# EAGLE design Player Board (EAGLE 6.2)
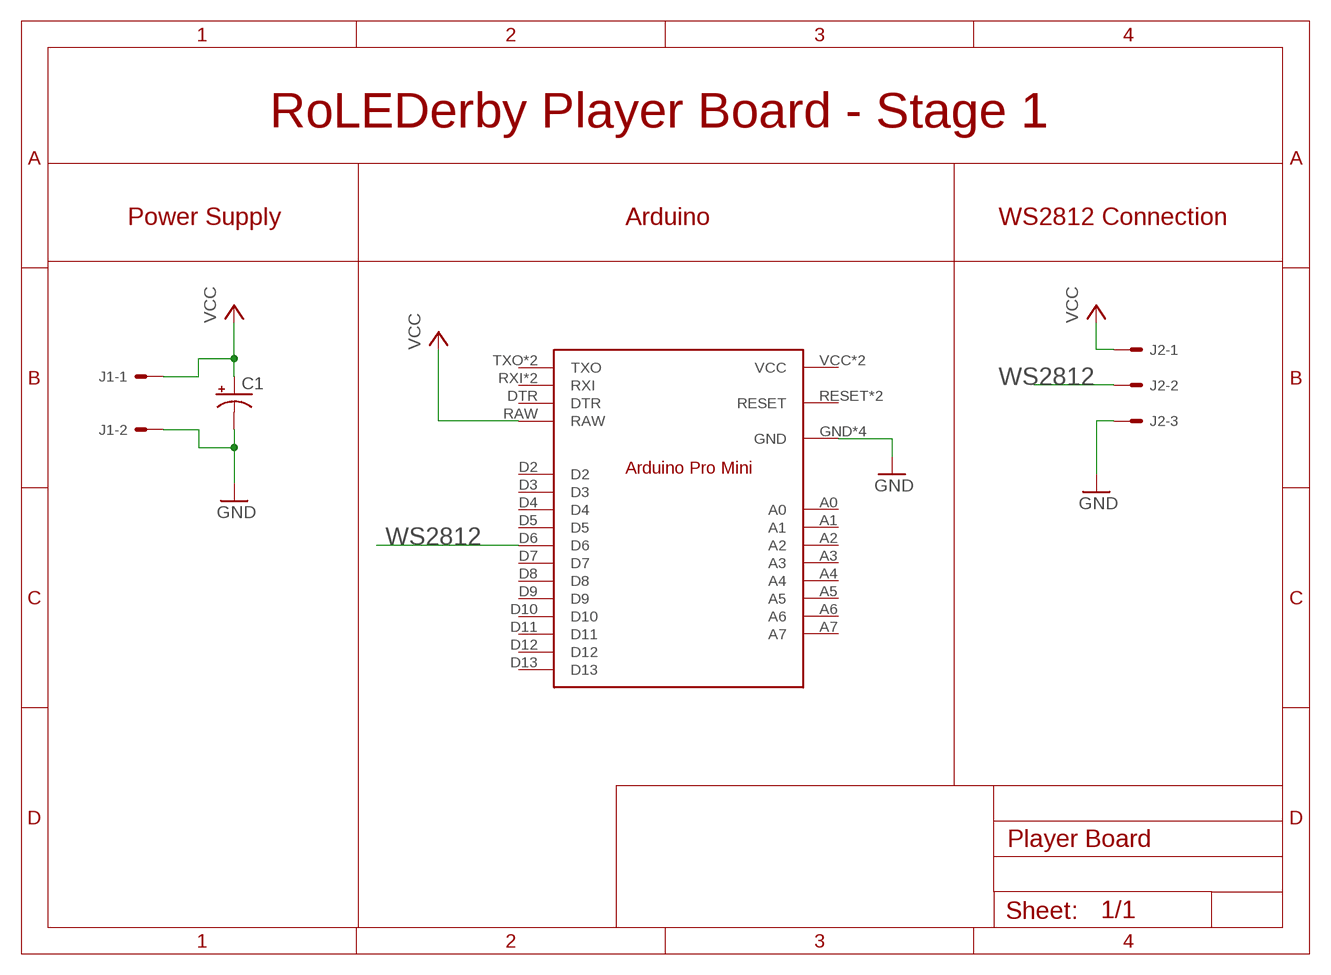
[diagram p0: schematic, sheet 1]

## Parts
C1  CAP_POLPTH2  [CPOL-RADIAL-10UF-25V]
J1  22-27-2021-02  [6410-02]
J2  22-27-2031-03  [6410-03]
U$1  ARDUINO_PRO_MINI  [ARDUINO_PRO_MINI]

## Nets
GND: C1.2(-) J1.2 J2.3 U$1.GND U$1.GND1(GND) U$1.GND2(GND) U$1.GND3(GND)
VCC: C1.1(+) J1.1 J2.1 U$1.RAW
WS2812: J2.2 U$1.D6
Unconnected: U$1.A0 U$1.A1 U$1.A2 U$1.A3 U$1.A4 U$1.A5 U$1.A6 U$1.A7 U$1.D2 U$1.D3 U$1.D4 U$1.D5 U$1.D7 U$1.D8 U$1.D9 U$1.D10 U$1.D11 U$1.D12 U$1.D13 U$1.DTR U$1.RESET U$1.RESET1(RESET) U$1.RXI U$1.RXI1(RXI) U$1.TXO U$1.TXO1(TXO) U$1.VCC U$1.VCC1(VCC)

## Notes on the sheet
- RoLEDerby Player Board - Stage 1
- Power Supply | Arduino | WS2812 Connection

## Library data of the parts
C1 = SparkFun-Capacitors:CAP_POL: Capacitor Polarized These are standard SMD and PTH capacitors. Normally 10uF, 47uF, and 100uF in electrolytic and tantalum varieties. Always verify the external diameter of the through hole cap, it varies with capacity, voltage, and manufacturer. The EIA devices should be standard.
J1 = con-molex:22-?-02: CONNECTOR wire to board 2.54 mm (.1 inch) pitch header; OC_FARNELL: unknown; OC_NEWARK: unknown
J2 = con-molex:22-?-03: CONNECTOR wire to board 2.54 mm (.1 inch) pitch header; OC_FARNELL: unknown; OC_NEWARK: unknown
U$1 = MimaZ:ARDUINO_PRO_MINI: Arduino Pro Mini http://arduino.cc/en/Main/ArduinoBoardProMini

## Board
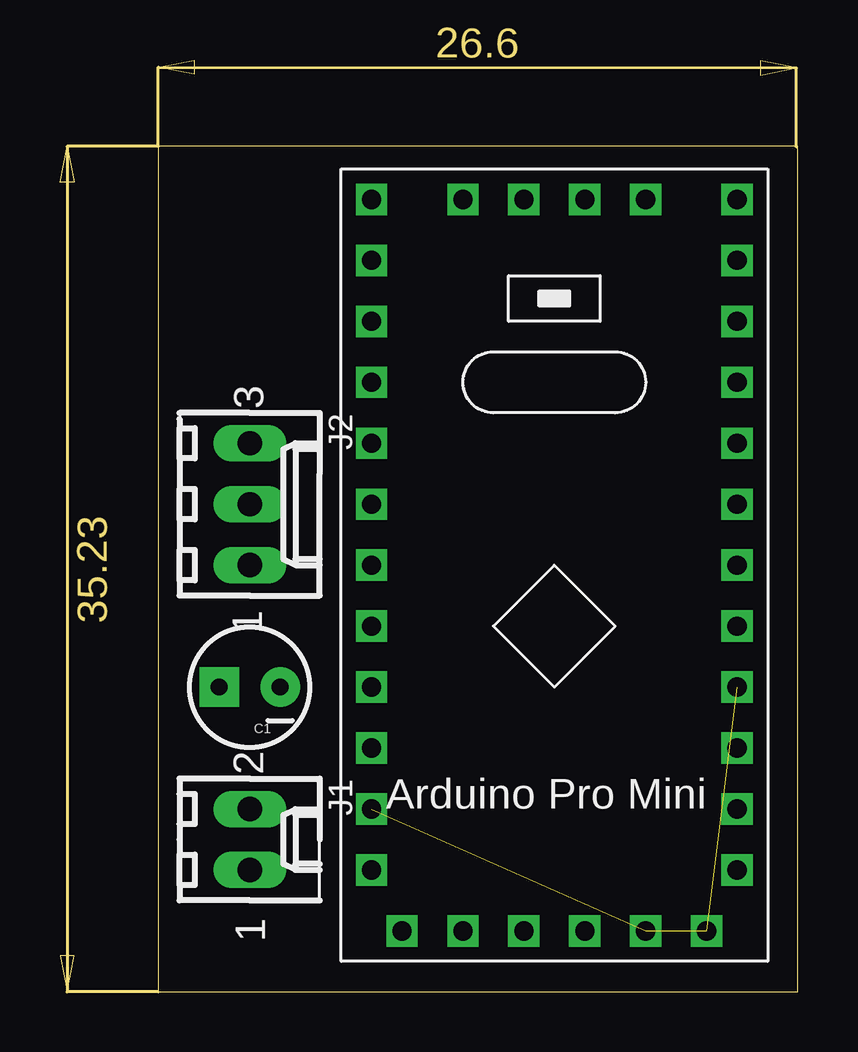
[diagram p1: board, top side]
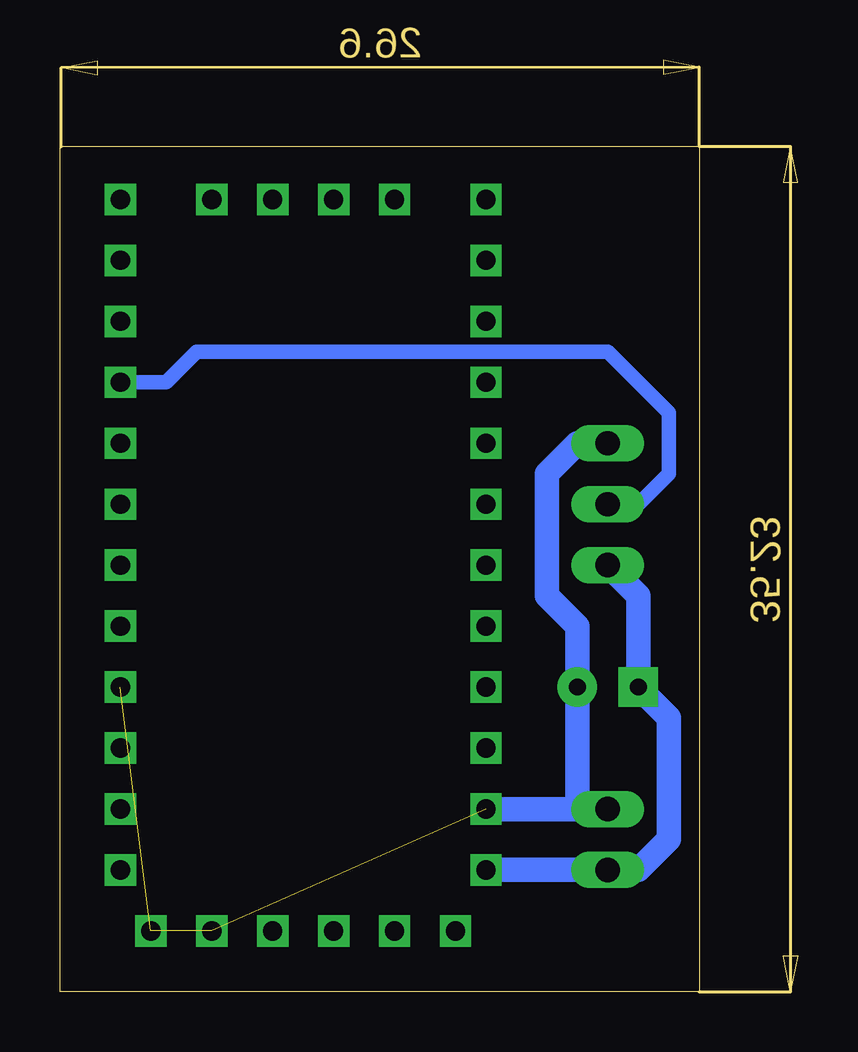
[diagram p2: board, bottom side, seen from below]

Size 26.65 x 35.23 mm. Coordinates in mm from the lower left corner, seen from the top.
Outline: 0,0 26.65,0 26.65,35.23 0,35.23 0,0
Copper layers (1*16): Top 0.035mm / dielectric 1.5mm / Bottom 0.035mm
Design rules: minimum track width 10mil, minimum drill 24mil, track to track 8mil, track to pad 8mil, pad to pad 8mil, via to via 8mil, smd to smd 8mil, copper to edge 40mil, drill to drill 8mil, minimum pad ring 10mil, minimum via ring 8mil, stop-mask expansion 4mil, vias tented up to drill 0mil, thermal gap 10mil

### Footprints (pad centres in the part's own frame; a part is rotated, then mirrored left to right if it is on the bottom)
CPOL-RADIAL-10UF-25V = drill 0.7 pad 1.651 square: 1 1.27,0 | drill 0.7 pad 1.651: 2 -1.27,0
6410-02 = drill 1.016 long: 1 1.27,0; 2 -1.27,0
6410-03 = drill 1.016 long: 1 2.54,0; 2 0,0; 3 -2.54,0
ARDUINO_PRO_MINI = drill 0.8 square: A0 15.24,-20.32; A1 15.24,-17.78; A2 15.24,-15.24; A3 15.24,-12.7; A4 3.81,-30.48; A5 6.35,-30.48; A6 8.89,-30.48; A7 11.43,-30.48; D2 0,-12.7; D3 0,-15.24; D4 0,-17.78; D5 0,-20.32; D6 0,-22.86; D7 0,-25.4; D8 0,-27.94; D9 0,-30.48; D10 15.24,-30.48; D11 15.24,-27.94; D12 15.24,-25.4; D13 15.24,-22.86; DTR 13.97,0; GND 0,-10.16; GND1 15.24,-5.08; GND2 1.27,0; GND3 3.81,0; RAW 15.24,-2.54; RESET 0,-7.62; RESET1 15.24,-7.62; RXI 0,-5.08; RXI1 8.89,0; TXO 0,-2.54; TXO1 11.43,0; VCC 15.24,-10.16; VCC1 6.35,0

### Placement (x,y rotation side)
C1  3.81,12.7 180 top
J1  3.81,6.35 270 top
J2  3.81,20.32 270 top
U$1  24.13,2.54 180 top

### Tracks (layer width: path | path; a pad name or v marks a point on that pad's centre or on a via)
GND  (3 unrouted)
  Bottom 1.016: U$1.GND1 J1.2 5.08,7.62 C1.2 5.08,15.24 6.35,16.51 6.35,21.59 5.08,22.86 J2.3
VCC
  Bottom 1.016: U$1.RAW J1.1 2.54,5.08 1.27,6.35 1.27,11.43 C1.1 2.54,16.51 J2.1
WS2812
  Bottom 0.61: J2.2 2.54,20.32 1.27,21.59 1.27,24.13 3.81,26.67 20.95,26.67 22.23,25.4 U$1.D6